# Altium schematic sheet Sheet1.SchDoc
size A3; DrawnBy: WwWangGuan; SheetNumber: 3; SheetTotal: 3
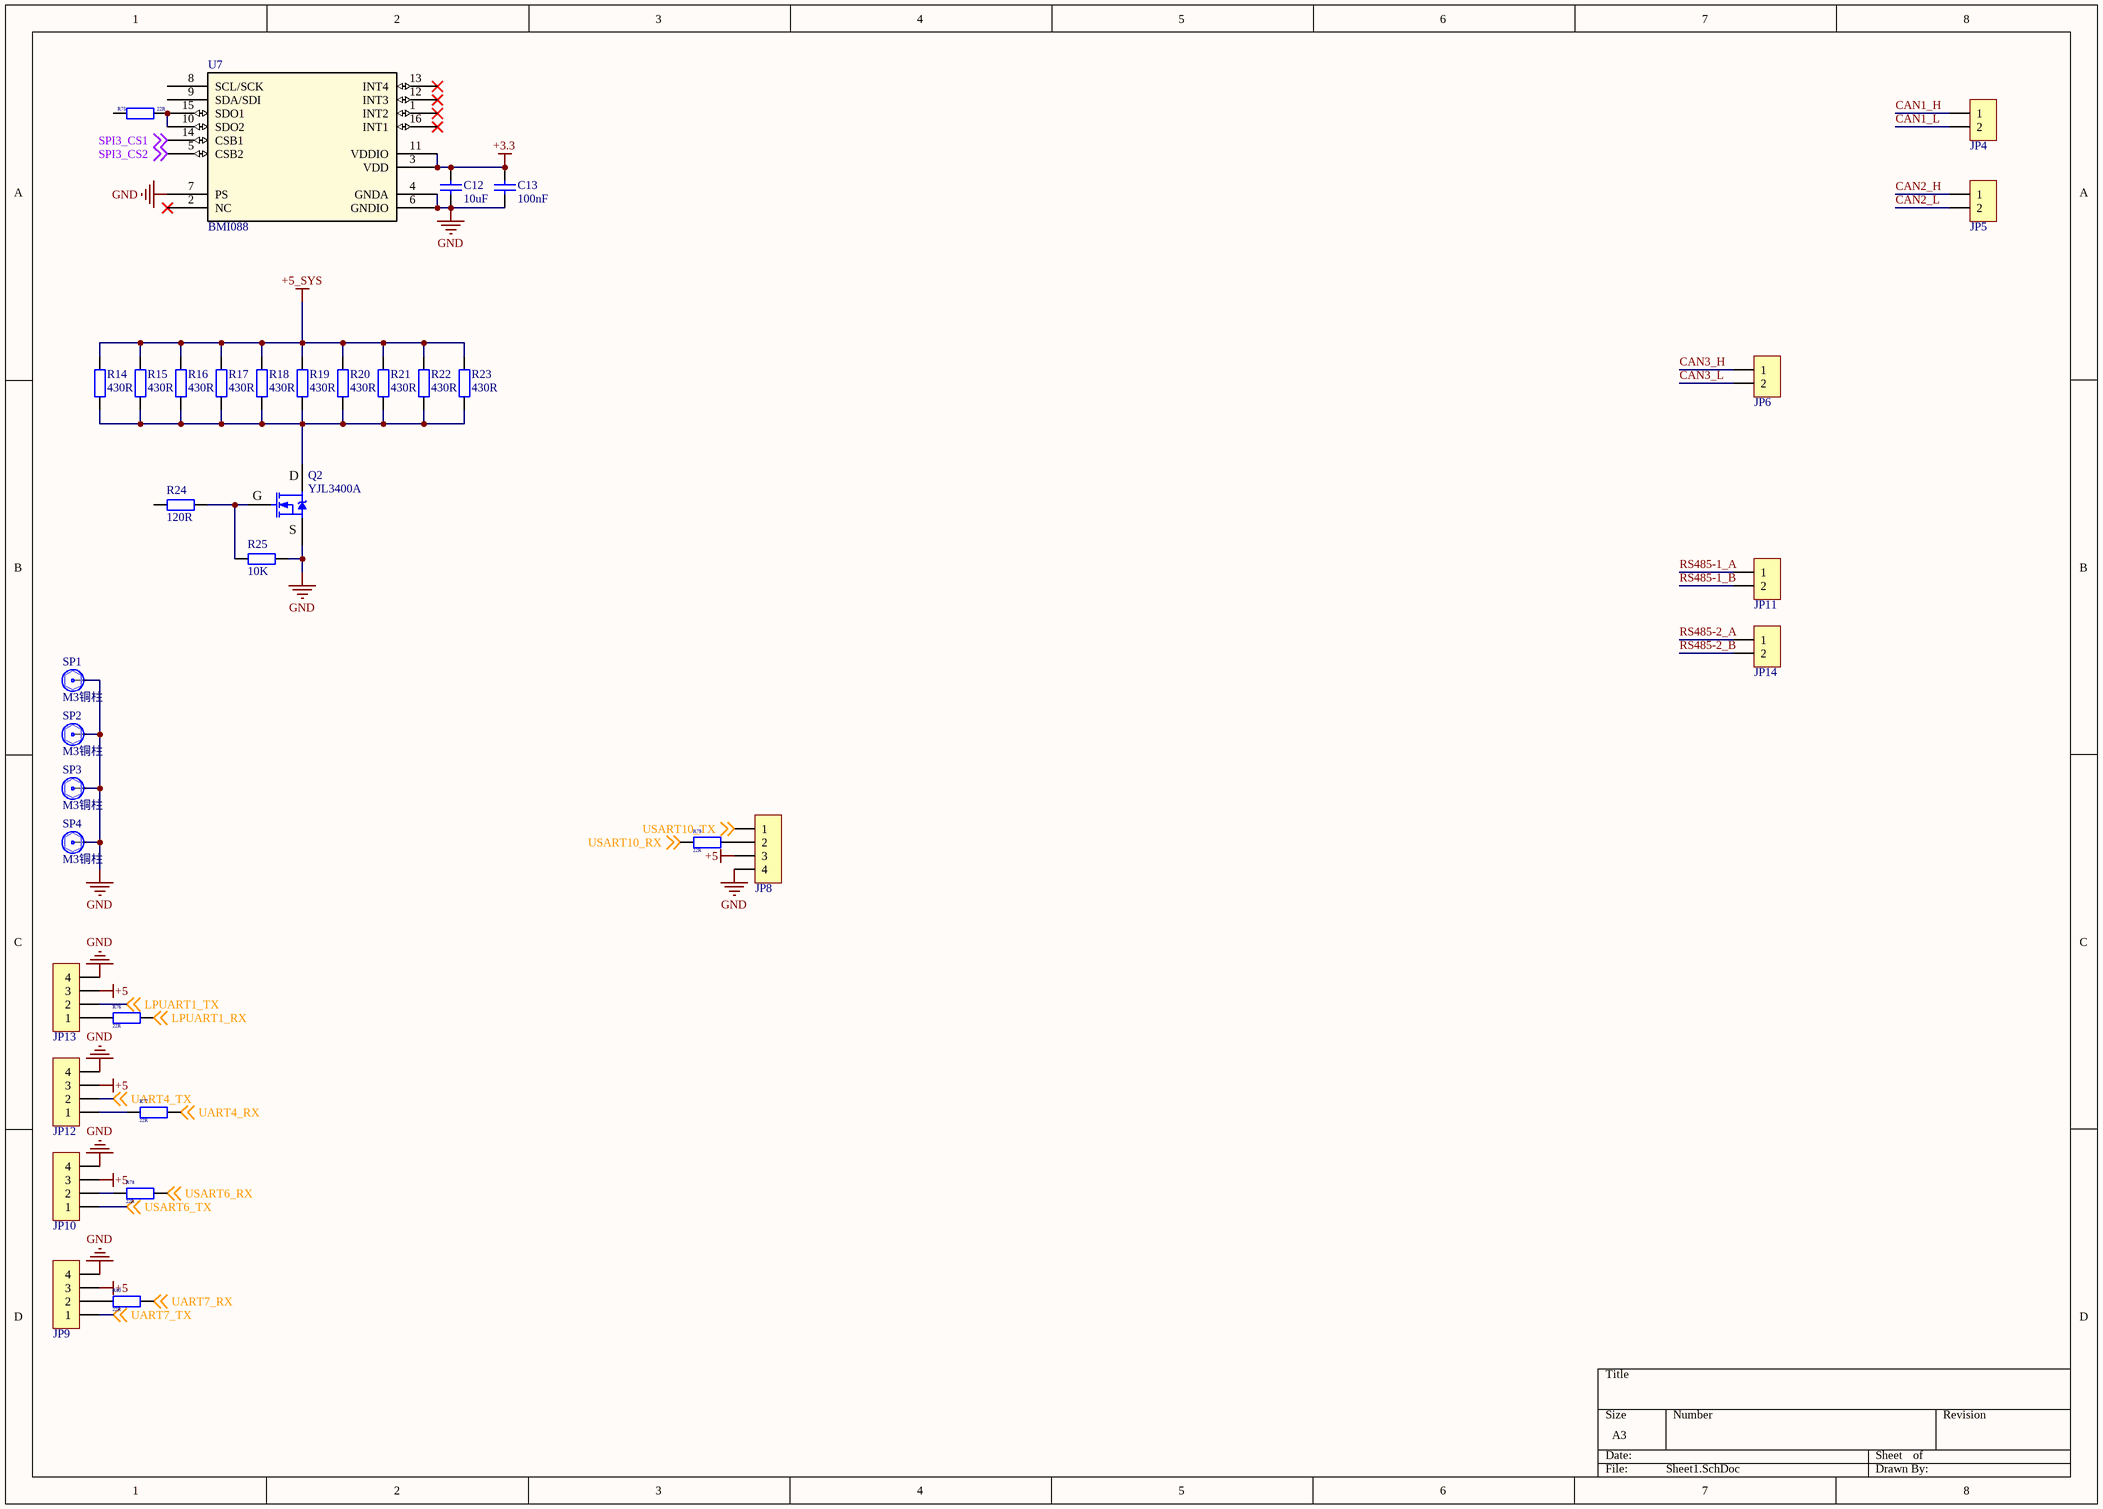
[diagram p0: Sheet1.SchDoc]

## Parts
C12  10uF  [C0402_M]
C13  100nF  [C0402_M]
JP4  HDR-1X2  [GH1.25-LT-2P]  (value not drawn)
JP5  HDR-1X2  [GH1.25-LT-2P]  (value not drawn)
JP6  HDR-1X2  [GH1.25-LT-2P]  (value not drawn)
JP8  HDR-1X4  [GH1.25-LT-4P]  (value not drawn)
JP9  HDR-1X4  [GH1.25-LT-4P]  (value not drawn)
JP10  HDR-1X4  [GH1.25-LT-4P]  (value not drawn)
JP11  HDR-1X2  [GH1.25-LT-2P]  (value not drawn)
JP12  HDR-1X4  [GH1.25-LT-4P]  (value not drawn)
JP13  HDR-1X4  [GH1.25-LT-4P]  (value not drawn)
JP14  HDR-1X2  [GH1.25-LT-2P]  (value not drawn)
Q2  YJL3400A  [SOT23-3L]
R14  430R  [R0402_M]
R15  430R  [R0402_M]
R16  430R  [R0402_M]
R17  430R  [R0402_M]
R18  430R  [R0402_M]
R19  430R  [R0402_M]
R20  430R  [R0402_M]
R21  430R  [R0402_M]
R22  430R  [R0402_M]
R23  430R  [R0402_M]
R24  120R  [R0402_M]
R25  10K  [R0402_M]
R75  22R  [R0402_M]
R76  22R  [R0402_M]
R77  22R  [R0402_M]
R78  22R  [R0402_M]
R79  22R  [R0402_M]
R80  22R  [R0402_M]
SP1  M3铜柱  [M3x4+6_N]
SP2  M3铜柱  [M3x4+6_N]
SP3  M3铜柱  [M3x4+6_N]
SP4  M3铜柱  [M3x4+6_N]
U7  BMI088  [QFN_BMI085_BOS]

## Nets
+3.3: C12.1 C13.1 U7.3(VDD) U7.11(VDDIO)
+5: JP8.3 JP9.3 JP10.3 JP12.3 JP13.3
+5_SYS: R14.2 R15.2 R16.2 R17.2 R18.2 R19.2 R20.2 R21.2 R22.2 R23.2
GND: C12.2 C13.2 JP8.4 JP9.4 JP10.4 JP12.4 JP13.4 Q2.2(S) R25.1 SP1.1 SP2.1 SP3.1 SP4.1 U7.4(GNDA) U7.6(GNDIO) U7.7(PS)
CAN1_H: JP4.1
CAN1_L: JP4.2
CAN2_H: JP5.1
CAN2_L: JP5.2
CAN3_H: JP6.1
CAN3_L: JP6.2
LPUART1_RX: R76.2 ; off-sheet LPUART1_RX
LPUART1_TX: JP13.2 ; off-sheet LPUART1_TX
RS485-1_A: JP11.1
RS485-1_B: JP11.2
RS485-2_A: JP14.1
RS485-2_B: JP14.2
SPI3_CS1: U7.14(CSB1) ; off-sheet SPI3_CS1
SPI3_CS2: U7.5(CSB2) ; off-sheet SPI3_CS2
UART4_RX: R77.2 ; off-sheet UART4_RX
UART4_TX: JP12.2 ; off-sheet UART4_TX
UART7_RX: R80.2 ; off-sheet UART7_RX
UART7_TX: JP9.1 ; off-sheet UART7_TX
USART6_RX: R78.2 ; off-sheet USART6_RX
USART6_TX: JP10.1 ; off-sheet USART6_TX
USART10_RX: R79.1 ; off-sheet USART10_RX
USART10_TX: JP8.1 ; off-sheet USART10_TX
NetJP8_2: JP8.2 R79.2
NetJP9_2: JP9.2 R80.1
NetJP10_2: JP10.2 R78.1
NetJP12_1: JP12.1 R77.1
NetJP13_1: JP13.1 R76.1
NetQ2_1: Q2.1(G) R24.1 R25.2
NetQ2_3: Q2.3(D) R14.1 R15.1 R16.1 R17.1 R18.1 R19.1 R20.1 R21.1 R22.1 R23.1
NetR75_1: R75.1 U7.10(SDO2) U7.15(SDO1)

Not connected (* = marked no-connect by the designer): R24 2; R75 2; U7 1(INT2)* 2(NC)* 8(SCL/SCK) 9(SDA/SDI) 12(INT3)* 13(INT4)* 16(INT1)*

## Library data of the parts
C12 C13 = CMP-002-000000-1: 贴片电容/MLCC电容; BOM名称: 无极性贴片电容; 当前库版本V2023.5.31 @淘宝卖家:黄晶宝石: 最新版本发布https://item.taobao.com/item.htm?id=566775463719; Design Item ID: C; Source: 0.1 - 电阻-电容-电感-保险丝-晶振-晶体-磁珠-电位器-法拉电容-馈通电容.SchLib
JP4-JP6 JP11 JP14 = Header 2: 2P连接器; 联系卖家 免费技术支持: 封装库来自淘宝卖家ID：黄晶宝石; BOM名称: 2P连接器
JP8-JP10 JP12 JP13 = Header 4: 4P连接器; 联系卖家 免费技术支持: 封装库来自淘宝卖家ID：黄晶宝石; BOM名称: 4P连接器
Q2 = SI2306: N沟道 30V/3.16A; BOM名称: N沟道场效应管; 联系下单店铺卖家 免费帮你查找封装: 联系下单店铺卖家 免费技术支持
R14-R25 = CMP-005-000000-1: 贴片电阻; 联系下单店铺卖家 免费帮你查找封装: 联系下单店铺卖家 免费技术支持; BOM名称: 贴片电阻; Source: 0.1 - 电阻-电容-电感-保险丝-晶振-晶体-磁珠-电位器-法拉电容-馈通电容.SchLib; Design Item ID: R
R75-R80 = R: 贴片电阻; 联系下单店铺卖家 免费帮你查找封装: 联系下单店铺卖家 免费技术支持; BOM名称: 贴片电阻
SP1-SP4 = 铜柱加头大焊盘: 铜柱; 联系下单店铺卖家 免费技术支持: 联系下单店铺卖家 免费帮你查找封装; BOM名称: 铜柱
U7 = CMP-00031-3: BMI088 Series 3.6 V 6 Axis Digital Output Accelerometer Motion Sensor - LGA-16; Axis: X, Y, Z; Max Operating Temperature: 85°C; Case/Package: LGA; Min Operating Temperature: -40°C; Packaging: Cut Tape; Pins: 16; Mounting Technology: Surface Mount